# EAGLE schematic internal_breakout (EAGLE 6.3)
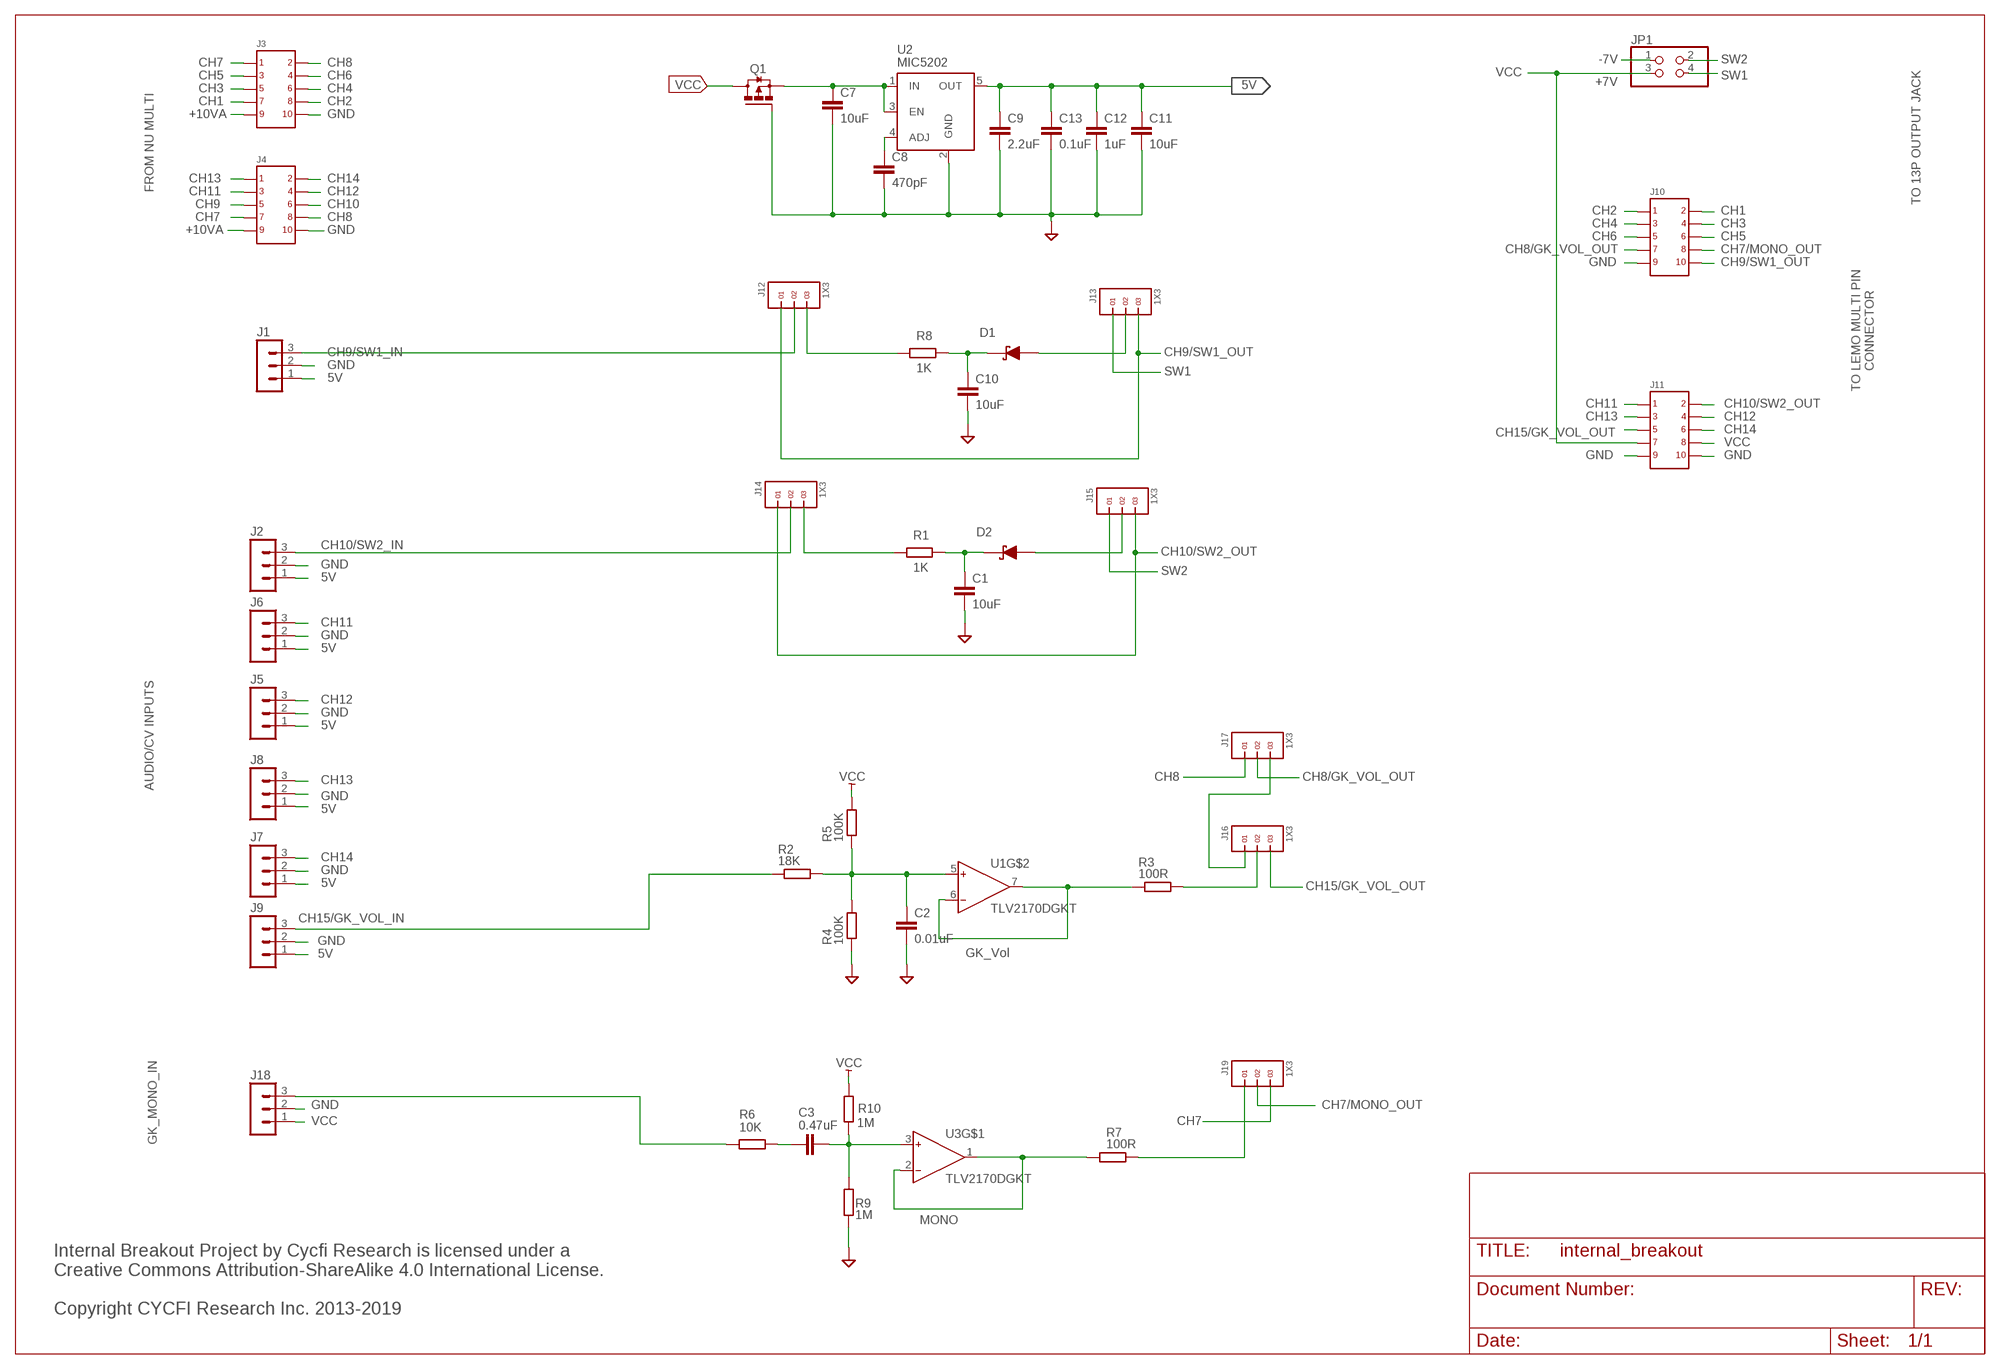
[diagram p0: schematic, sheet 1]

## Parts
C1  10uF  C-EUC0603  [C0603]
C2  0.01uF  C-EUC0402  [C0402]
C3  0.47uF  C-EUC0603  [C0603]
C7  10uF  C-EUC0603  [C0603]
C8  470pF  C-EUC0402  [C0402]
C9  2.2uF  C-EUC0603  [C0603]
C10  10uF  C-EUC0603  [C0603]
C11  10uF  C-EUC0603  [C0603]
C12  1uF  C-EUC0603  [C0603]
C13  0.1uF  C-EUC0402  [C0402]
D1  D_SCHOTTKYL  [SOD-323]
D2  D_SCHOTTKYL  [SOD-323]
J1  MA03-1  [MA03-1]
J2  MA03-1  [MA03-1]
J3  2X5  [2X5]
J4  2X5  [2X5]
J5  MA03-1  [MA03-1]
J6  MA03-1  [MA03-1]
J7  MA03-1  [MA03-1]
J8  MA03-1  [MA03-1]
J9  MA03-1  [MA03-1]
J10  2X5  [2X5]
J11  2X5  [2X5]
J12  1X3  [1X3]
J13  1X3  [1X3]
J14  1X3  [1X3]
J15  1X3  [1X3]
J16  1X3  [1X3]
J17  1X3  [1X3]
J18  MA03-1  [MA03-1]
J19  1X3  [1X3]
JP1  PINHD-2X02_2.00  [2X02M]
Q1  DMP3099L  FDN360P  [SUPER-SOT3]
R1  1K  R-EU_R0402  [R0402]
R2  18K  R-EU_R0402  [R0402]
R3  100R  R-EU_R0402  [R0402]
R4  100K  R-EU_R0402  [R0402]
R5  100K  R-EU_R0402  [R0402]
R6  10K  R-EU_R0402  [R0402]
R7  100R  R-EU_R0402  [R0402]
R8  1K  R-EU_R0402  [R0402]
R9  1M  R-EU_R0402  [R0402]
R10  1M  R-EU_R0402  [R0402]
U1  TLV2170DGKT  [MSOP8]
U2  MIC5205-5V  MIC5219BM5  [SOT23-5]
U3  TLV2170DGKT  [MSOP8]

## Nets
5V: C9.1 C11.1 C12.1 C13.1 J1.1 J2.1 J5.1 J6.1 J7.1 J8.1 J9.1 U2.5(OUT)
-7V: JP1.1
CH1: J3.7 J10.2
CH2: J3.8 J10.1
CH3: J3.5 J10.4
CH4: J3.6 J10.3
CH5: J3.3 J10.6
CH6: J3.4 J10.5
CH7: J3.1 J4.7 J19.3
CH7/MONO_OUT: J10.8 J19.2
CH8: J3.2 J4.8 J17.1
CH8/GK_VOL_OUT: J10.7 J17.2
CH9: J4.5
CH9/SW1_IN: J1.3 J12.2
CH9/SW1_OUT: J10.10 J12.1 J13.3
CH10: J4.6
CH10/SW2_IN: J2.3 J14.2
CH10/SW2_OUT: J11.2 J14.1 J15.3
CH11: J4.3 J6.3 J11.1
CH12: J4.4 J5.3 J11.4
CH13: J4.1 J8.3 J11.3
CH14: J4.2 J7.3 J11.6
CH15/GK_VOL_IN: J9.3 R2.1
CH15/GK_VOL_OUT: J11.5 J16.3
GND: C1.2 C2.2 C7.2 C8.2 C9.2 C10.2 C11.2 C12.2 C13.2 J1.2 J2.2 J3.10 J4.10 J5.2 J6.2 J7.2 J8.2 J9.2 J10.9 J11.9 J11.10 J18.2 Q1.1(G) R4.1 R9.2 U2.2(GND)
N$1: C7.1 Q1.2(S) U2.1(IN) U2.3(EN)
N$2: J12.3 R8.1
N$3: C8.1 U2.4(ADJ)
N$4: C1.1 D2.2(C) R1.2
N$5: D2.1(A) J15.2
N$6: J14.3 R1.1
N$7: J19.1 R7.1
N$8: J16.1 J17.3
N$11: R3.1 U1.6(IN-) U1.7(OUT)
N$12: C2.1 R2.2 R4.2 R5.1 U1.5(IN+)
N$14: C3.2 R6.2
N$15: C3.1 R9.1 R10.1 U3.3(IN+)
N$16: R7.2 U3.1(OUT) U3.2(IN-)
N$17: J16.2 R3.2
N$18: D1.1(A) J13.2
N$22: J18.3 R6.1
N$26: C10.1 D1.2(C) R8.2
SW1: J13.1 JP1.4
SW2: J15.1 JP1.2
V+: J3.9 J4.9
VCC: J11.7 J11.8 J18.1 JP1.3 Q1.3(D) R5.2 R10.2
Unconnected: U1.1(OUT) U1.2(IN-) U1.3(IN+) U3.5(IN+) U3.6(IN-) U3.7(OUT)

## Notes on the sheet
- CH7 | CH8 | MIC5202
- CH5 | CH6
- +7V
- CH3 | CH4
- CH1 | CH2
- +10VA | GND
- FROM NU MULTI
- TO 13P OUTPUT JACK
- +10VA | GND
- TO LEMO MULTI PIN
  CONNECTOR
- AUDIO/CV INPUTS
- GK_Vol
- GK_MONO_IN
- MONO
- Internal Breakout Project by Cycfi Research is licensed under a 
  Creative Commons Attribution-ShareAlike 4.0 International License. 
  
  Copyright CYCFI Research Inc. 2013-2019

## Power pins joined to a net without a drawn wire
V+: U1.8(V+) U3.8(V+)
V-: U1.4(V-) U3.4(V-)

## Library data of the parts
C1-C3 C7-C13 = resistor:C-EU: CAPACITOR, European symbol
D1 D2 = m-pad-2.1:D_SCHOTTKY: Schottky diodes in various packages
J1 J2 J5-J9 J18 = con-lstb:MA03-1: PIN HEADER; OC_FARNELL: unknown; OC_NEWARK: unknown
J3 J4 J10 J11 = headers(2mm):2X5
J12-J17 J19 = headers(2mm):1X3
JP1 = pinhead-2:PINHD-2X02: PIN HEADER
Q1 = transistor-power:FDN360P: Single P-Channel, PowerTrench (R) MOSFET Source: http://www.fairchildsemi.com/ds/FD/FDN360P.pdf
R1-R10 = resistor:R-EU_: RESISTOR, European symbol
U1 U3 = CYCFI_semicon:TLV2170DGKT
U2 = v-reg-micrel:MIC5219BM5: VOLTAGE REGULATOR; MF: ALTERA CORPORATION; MPN: MIC5219BM5 TR; OC_FARNELL: 1100656; OC_NEWARK: 09J8939